# EAGLE design int_esp_8266 (EAGLE 9.2.2)
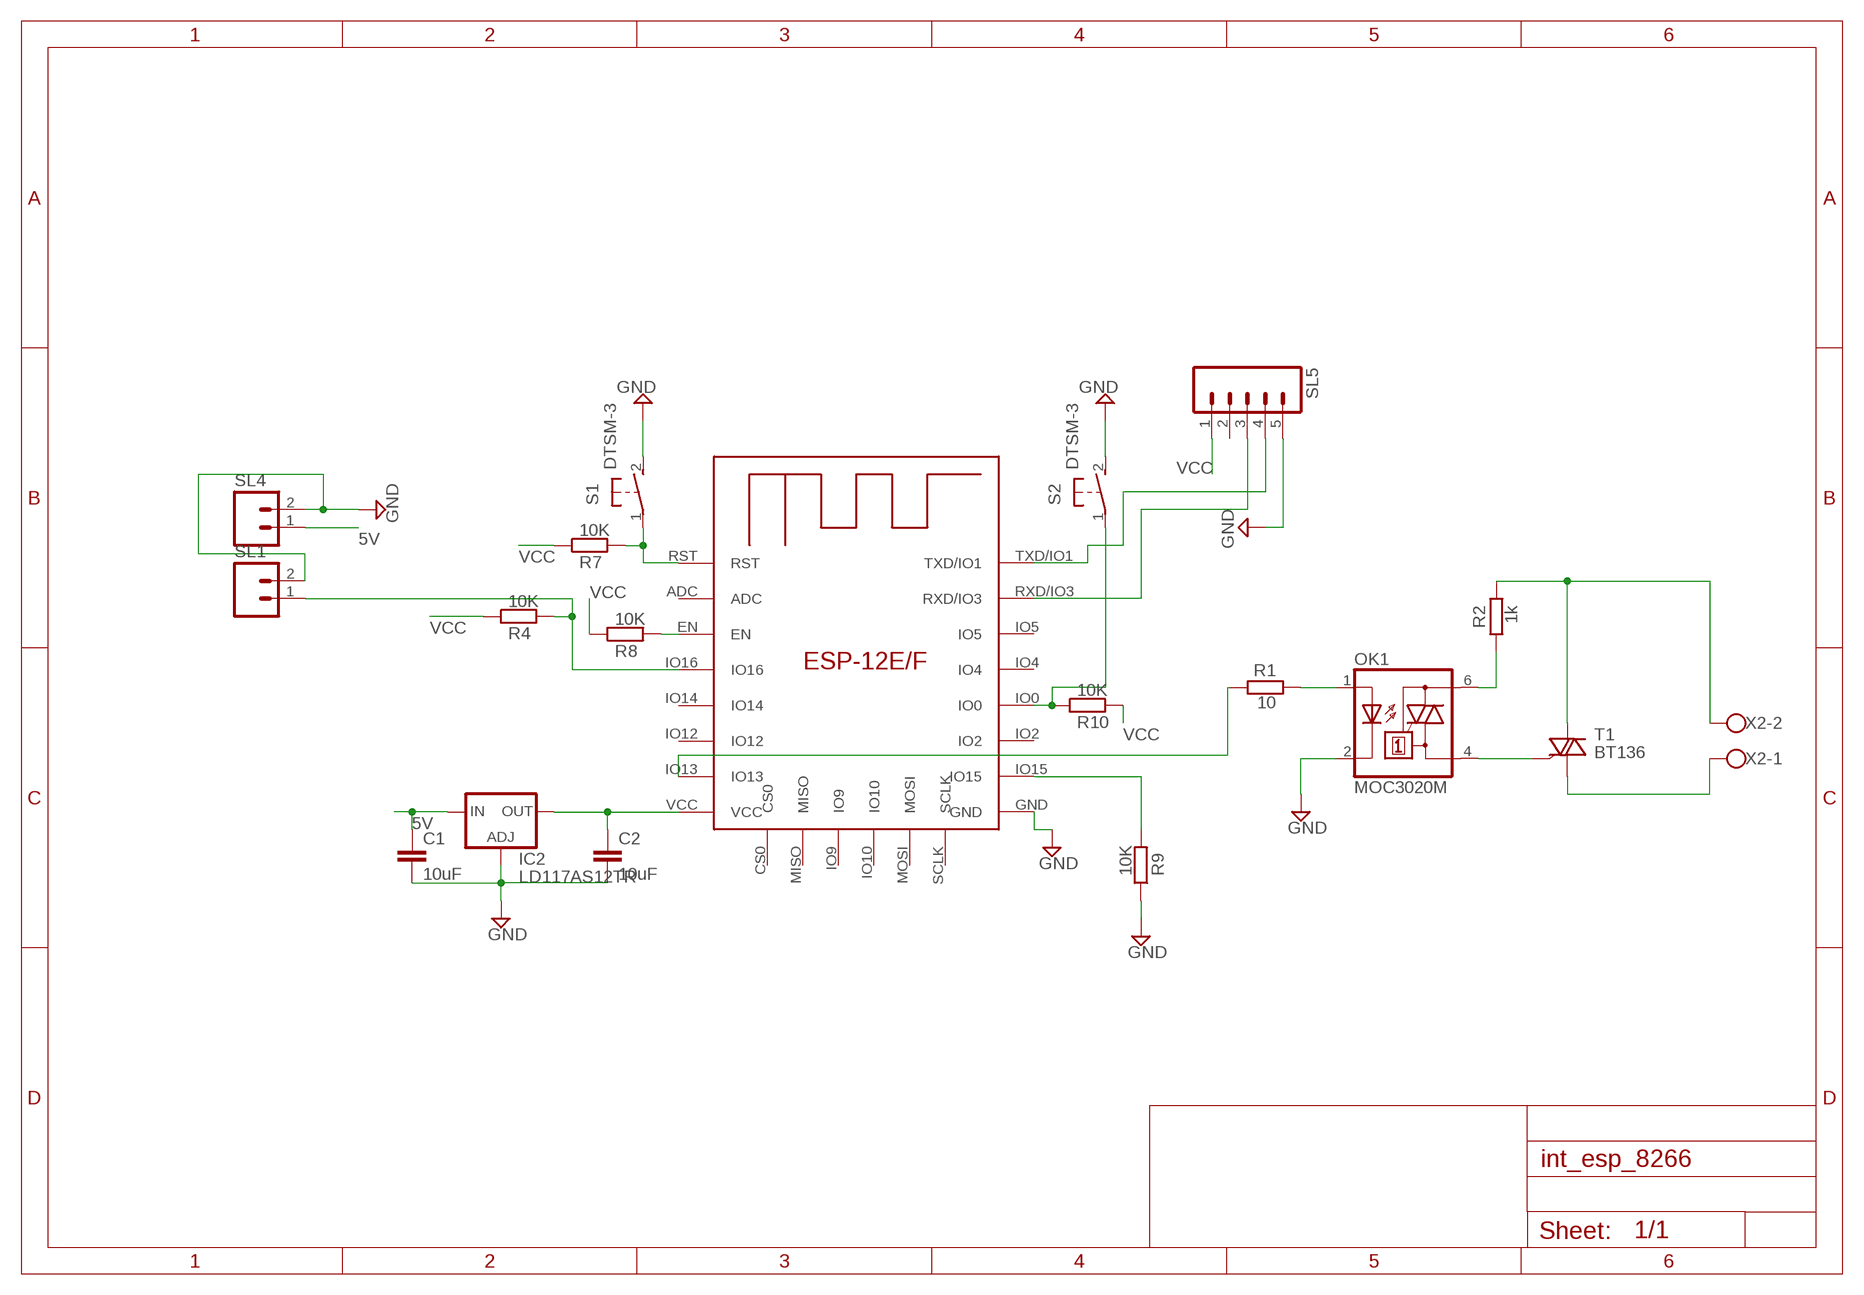
[diagram p0: schematic, sheet 1]

## Parts
C1  10uF  C-EUC0805  [C0805]
C2  10uF  C-EUC0805  [C0805]
IC1  ESP-12E/F  [ESP-12E]
IC2  LD117AS12TR  [SOT223]
OK1  MOC3020M  [DIL06]
R1  10  R-EU_M0805  [M0805]
R2  1k  R-EU_M0805  [M0805]
R4  10K  R-EU_M0805  [M0805]
R7  10K  R-EU_M0805  [M0805]
R8  10K  R-EU_M0805  [M0805]
R9  10K  R-EU_M0805  [M0805]
R10  10K  R-EU_M0805  [M0805]
S1  DTSM-3  [DTSM-3]
S2  DTSM-3  [DTSM-3]
SL1  M02  [02P]
SL4  M02  [02P]
SL5  M05  [05P]
T1  BT136  [TO220AB]
X2  W237-102  [W237-102]

## Nets
5V: C1.1 IC2.3(IN) SL4.1
GND: C1.2 C2.2 IC1.GND IC2.1(ADJ) OK1.2(C) R9.1 S1.2 S2.2 SL1.2 SL4.2 SL5.5
N$1: IC1.IO13 R1.2
N$2: OK1.4(A1) T1.3(G)
N$3: IC1.IO15 R9.2
N$4: OK1.1(A) R1.1
N$5: IC1.RST R7.2 S1.1
N$6: OK1.6(A2) R2.2
N$7 [triac]: R2.1 T1.2(A2) X2.2
N$8 [triac]: T1.1(A1) X2.1
N$20: IC1.IO16 R4.2 SL1.1
N$23: IC1.EN R8.2
N$24: IC1.IO0 R10.1 S2.1
N$25: IC1.RXD/IO3 SL5.3
N$26: IC1.TXD/IO1 SL5.4
VCC: C2.1 IC1.VCC IC2.4(OUT) R4.1 R7.1 R8.1 R10.2 SL5.1
Unconnected: IC1.ADC IC1.CS0 IC1.IO2 IC1.IO4 IC1.IO5 IC1.IO9 IC1.IO10 IC1.IO12 IC1.IO14 IC1.MISO IC1.MOSI IC1.SCLK SL5.2

## Library data of the parts
C1 C2 = rcl:C-EU: CAPACITOR, European symbol; SPICEPREFIX: C
IC1 = esp-12e-f:ESP-12E/F
IC2 = v-reg:LD117A?*: Low drop fixed and adjustable positive voltage regulators 1 A Source: http://www.st.com/stonline/products/literature/ds/7194/ld1117axx.pdf
OK1 = optocoupler:MOC30*M: RANDOM-PHASE OPTOISOLATORS TRIAC DRIVER OUTPUT Source: http://www.fairchildsemi.com MOC3020-M.pdf; MF: FAIRCHILD SEMICONDUCTOR; MPN: MOC3020-M; OC_FARNELL: 1505425; OC_NEWARK: 72K8895
R1 R2 R4 R7-R10 = rcl:R-EU_: RESISTOR, European symbol; SPICEPREFIX: R
S1 S2 = switch-tact:DTSM-3
SL1 SL4 = con-amp-quick:M02: AMP QUICK CONNECTOR; OC_FARNELL: unknown; OC_NEWARK: unknown
SL5 = con-amp-quick:M05: AMP QUICK CONNECTOR; OC_FARNELL: unknown; OC_NEWARK: unknown
T1 = triac:BT136: Triac BT136 series E sensitive gate Source: http://www.nxp.com/acrobat_download/datasheets/BT136_SERIES_E_2.pdf
X2 = con-wago-500:W237-102: WAGO SCREW CLAMP; MPN: 237-102; OC_FARNELL: unknown; OC_NEWARK: 70K9898

## Net classes
1 rele: width 2.794 mm, drill 1 mm
2 triac: width 1.27 mm, drill 1 mm

## Board
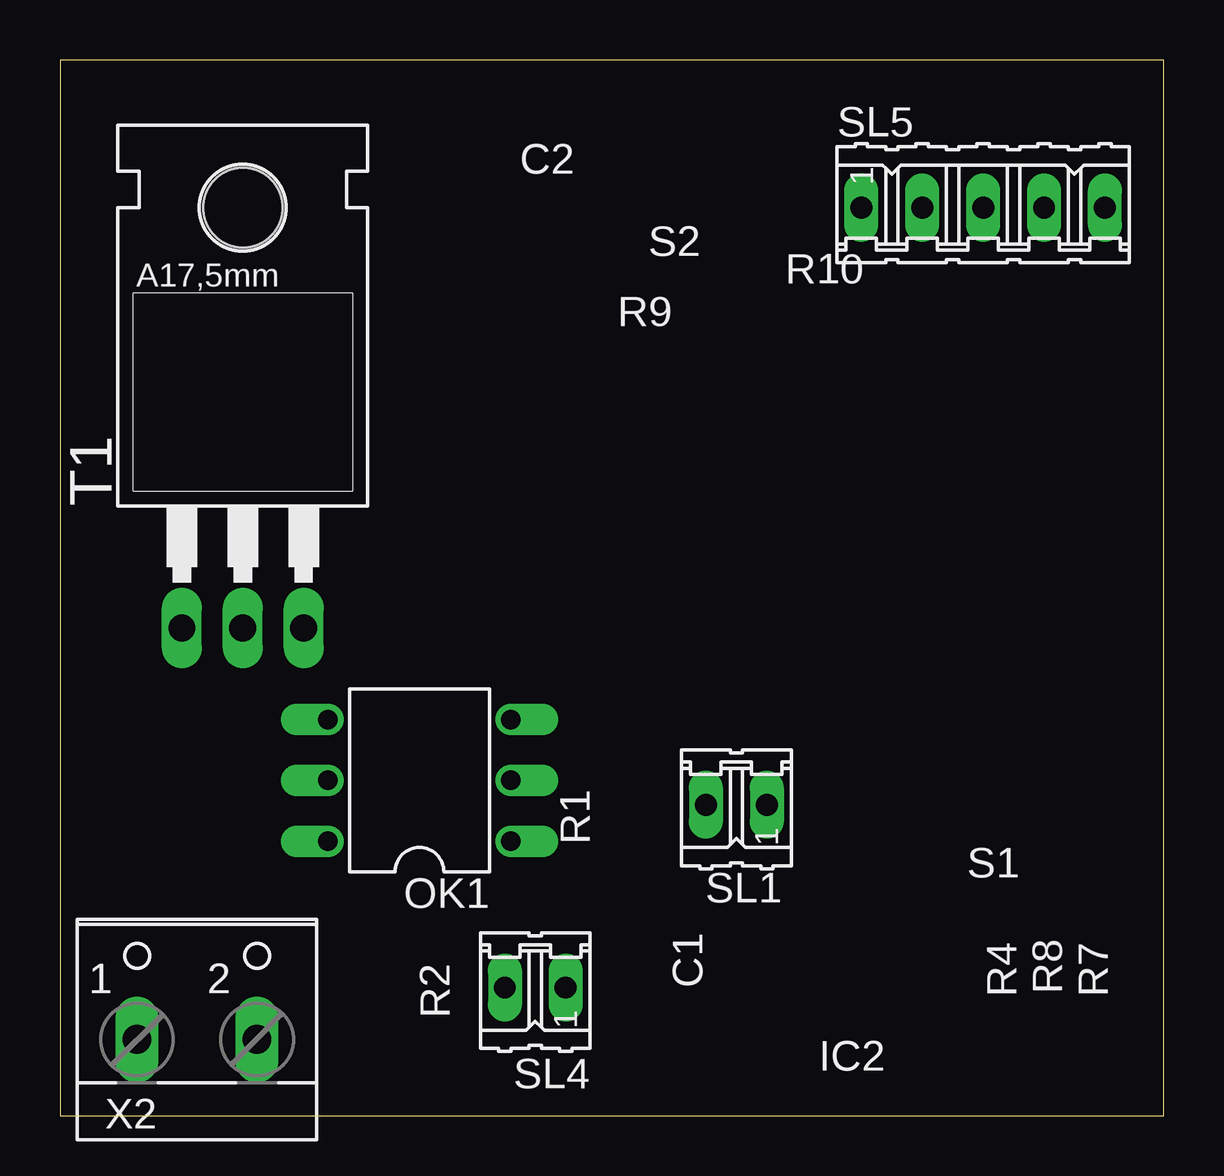
[diagram p1: board, top side]
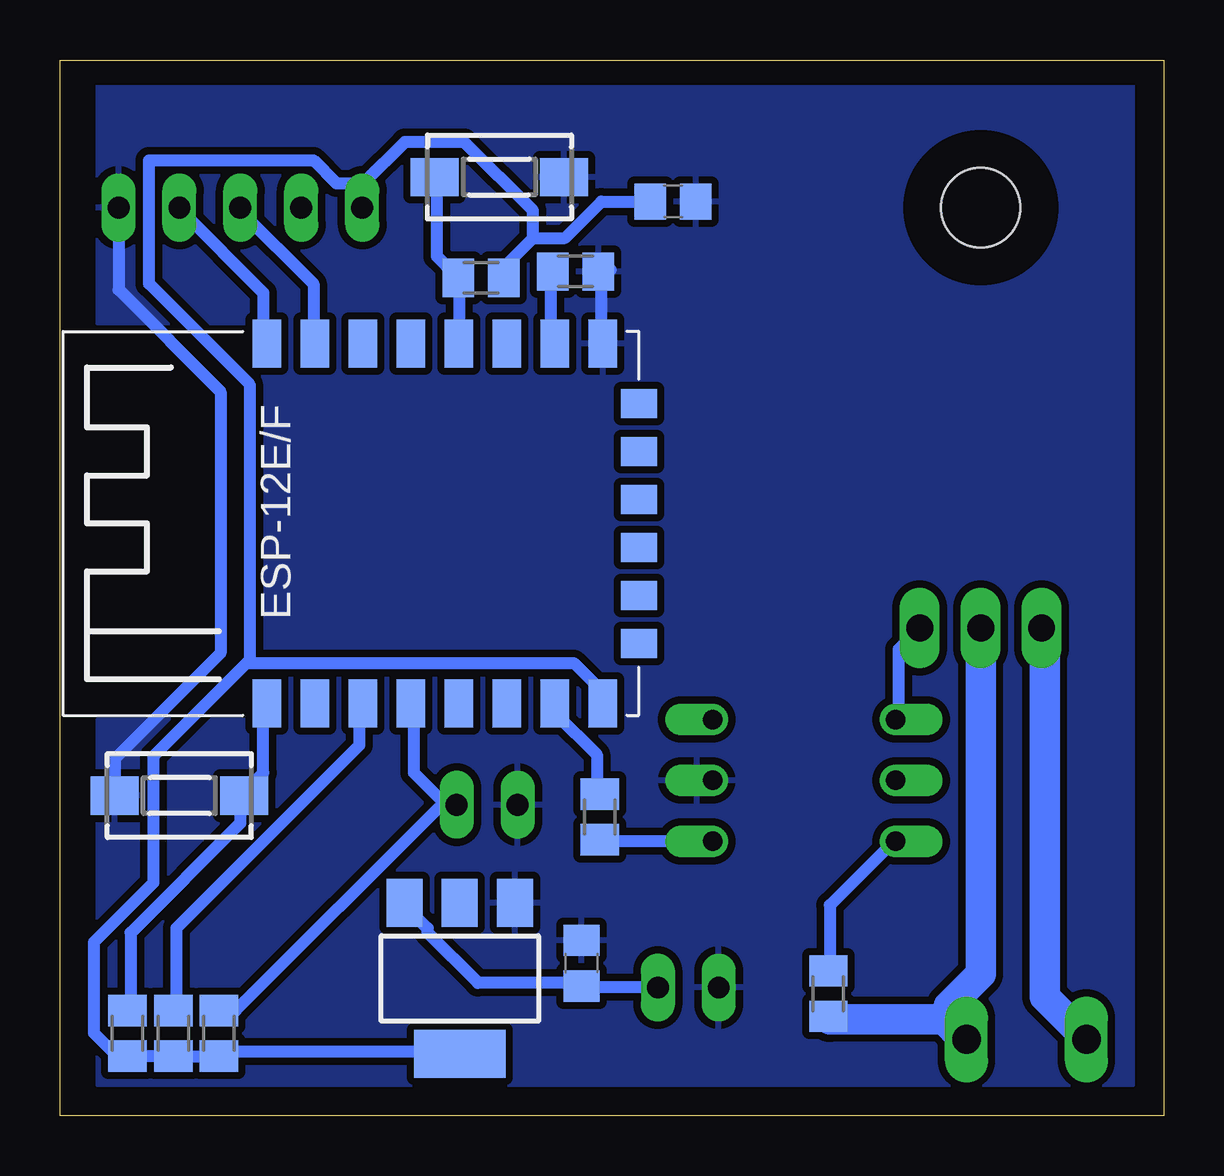
[diagram p2: board, bottom side, seen from below]

Size 46 x 44 mm. Coordinates in mm from the lower left corner, seen from the top.
Outline: 0,0 46,0 46,44 0,44 0,0
Copper layers (1*16): Top 0.035mm / dielectric 1.5mm / Bottom 0.035mm
Design rules "default *": minimum track width 20mil, minimum drill 0.35mm, track to track 10mil, track to pad 10mil, pad to pad 10mil, via to via 10mil, smd to smd 10mil, copper to edge 40mil, drill to drill 10mil, minimum pad ring 10mil, minimum via ring 8mil, stop-mask expansion 4mil, vias tented up to drill 0mil, thermal gap 12mil

### Footprints (pad centres in the part's own frame; a part is rotated, then mirrored left to right if it is on the bottom)
C0805 = smd 1.3 x 1.5: 1 -0.95,0; 2 0.95,0
ESP-12E = smd 2 x 1.2: ADC -7.46,5.53; EN -7.46,3.53; GND 7.54,-6.47; IO0 7.54,-0.47; IO2 7.54,-2.47; IO4 7.54,1.53; IO5 7.54,3.53; IO12 -7.46,-2.47; IO13 -7.46,-4.47; IO14 -7.46,-0.47; IO15 7.54,-4.47; IO16 -7.46,1.53; RST -7.46,7.53; RXD/IO3 7.54,5.53; TXD/IO1 7.54,7.53; VCC -7.46,-6.47 | smd 1.2 x 1.5: CS0 -4.96,-7.97; IO9 -0.96,-7.97; IO10 1.04,-7.97; MISO -2.96,-7.97; MOSI 3.04,-7.97; SCLK 5.04,-7.97
SOT223 = smd 1.5 x 2: 1 -2.3,-3.15; 2 0,-3.15; 3 2.3,-3.15 | smd 3.8 x 2: 4 0,3.15
DIL06 = drill 0.813 offset: 1 -2.54,-3.81; 2 0,-3.81; 3 2.54,-3.81; 4 2.54,3.81; 5 0,3.81; 6 -2.54,3.81
M0805 = smd 1.3 x 1.6: 1 -0.95,0; 2 0.95,0
DTSM-3 = smd 2 x 1.6: 1 -2.7,0; 2 2.7,0
02P = drill 0.914 long: 1 -1.27,0; 2 1.27,0
05P = drill 0.914 long: 1 -5.08,0; 2 -2.54,0; 3 0,0; 4 2.54,0; 5 5.08,0
TO220AB = drill 1.118 long: 1 -2.54,-6.35; 2 0,-6.35; 3 2.54,-6.35 | hole 3.302: 0,11.176
W237-102 = drill 1.194 long: 1 -2.5,-1.27; 2 2.5,-1.27

### Placement (x,y rotation side)
C1  24.26,6.35 90 bottom
C2  20.45,38.1 0 bottom
IC1  29.84,24.64 90 bottom
IC2  29.34,5.71 180 bottom
OK1  14.99,13.97 90 top
R1  23.5,12.45 90 bottom
R2  13.97,5.08 90 bottom
R4  39.37,3.43 90 bottom
R7  43.18,3.43 90 bottom
R8  41.27,3.43 90 bottom
R9  24.51,35.18 180 bottom
R10  28.45,34.92 0 bottom
S1  41.02,13.34 180 bottom
S2  27.69,39.12 0 bottom
SL1  28.19,12.95 180 top
SL4  19.81,5.33 180 top
SL5  38.48,37.85 0 top
T1  7.62,26.67 0 top
X2  5.71,4.45 0 top

### Tracks (layer width: path | path; a pad name or v marks a point on that pad's centre or on a via)
5V
  Bottom 0.508: SL4.1 24.19,5.33 C1.1 24.38,5.52 28.57,5.52 30.67,7.62 30.67,7.81 31.62,8.76 IC2.3
GND
  Bottom 0.508: 24.38,7.43 C1.2 | 26.86,8.76 IC2.1 | 24.19,7.43 C1.2 | 27.05,8.95 IC2.1 | R9.1 23.43,35.05 23.43,32.19 IC1.GND 23.24,32 | 24.96,39.24 S2.2 | 19.43,38.29 C2.2 | 23.24,35.05 R9.1 | 19.43,37.91 C2.2 | S1.2 43.72,14.86 39.31,19.27 39.31,30.16 43.56,34.42 SL5.5 43.43,37.91 | 25.15,39.24 S2.2 | 24.57,7.43 C1.2 | 26.67,8.76 IC2.1 | 27.05,9.14 IC2.1 | 19.43,37.72 C2.2 | 23.05,35.24 R9.1 | 24.77,39.24 S2.2 | 19.43,38.48 C2.2 | 25.34,39.24 S2.2
  pour Bottom (isolate 0.305): 1.27,43.18 44.45,43.18 44.45,33.02 38.1,33.02 38.1,16.51 44.45,16.51 44.45,1.27 1.27,1.27
N$1
  Bottom 0.508: R1.2 23.62,13.53 23.62,15.05 25.34,16.76 25.34,17.14 IC1.IO13
N$2
  Bottom 0.508: T1.3 11.05,19.43 11.05,16.57 OK1.4
N$3
  Bottom 0.508: R9.2 25.53,35.05 25.53,32.19 IC1.IO15
N$4
  Bottom 0.508: OK1.1 23.43,11.43 R1.1
N$5
  Bottom 0.508: R7.2 43.05,4.38 43.05,7.62 38.48,12.19 38.48,13.34 S1.1 38.29,13.53 37.53,14.29 37.53,17.14 IC1.RST
N$6
  Bottom 0.508: R2.2 13.91,6.1 13.91,8.76 11.24,11.43 OK1.6
N$7
  Bottom 1.27: R2.1 13.91,4 9.14,4 8.38,3.24 X2.2 8.95,4.57 7.62,5.91 T1.2
N$8
  Bottom 1.27: T1.1 4.95,20.19 4.95,4.95 3.24,3.24 X2.1
N$20
  Bottom 0.508: R4.2 39.24,4.38 38.67,4.38 30.1,12.95 SL1.1 30.1,13.14 31.24,14.29 31.24,17.14 IC1.IO16
N$23
  Bottom 0.508: R8.2 41.15,4.38 41.15,7.81 33.53,15.43 33.53,17.14 IC1.EN
N$24
  Bottom 0.508: IC1.IO0 29.34,32.19 29.34,34.86 R10.1 29.53,35.05 30.29,35.81 30.29,39.05 S2.1
N$25
  Bottom 0.508: IC1.RXD/IO3 35.43,32.19 35.43,34.67 38.48,37.72 SL5.3
N$26
  Bottom 0.508: IC1.TXD/IO1 37.53,32.19 37.53,34.29 40.96,37.72 SL5.4
VCC
  Bottom 0.508: C2.1 23.43,38.1 24.96,36.58 26.29,36.58 | 26.29,36.58 27.43,35.43 27.43,35.05 R10.2 | 26.29,36.58 26.29,37.72 29.15,40.58 31.62,40.58 33.34,38.86 33.34,37.91 SL5.1 33.53,38.86 34.48,38.86 35.43,39.81 42.29,39.81 42.29,34.67 38.1,30.48 38.1,18.99 | 38.1,18.99 42.1,14.99 42.1,9.72 44.58,7.24 44.58,3.43 43.62,2.48 43.43,2.48 R7.1 43.05,2.48 41.53,2.48 R8.1 41.15,2.48 39.43,2.48 R4.1 39.24,2.67 29.34,2.67 IC2.4 | IC1.VCC 23.43,17.34 23.43,17.72 24.57,18.86 38.1,18.86 38.1,18.99